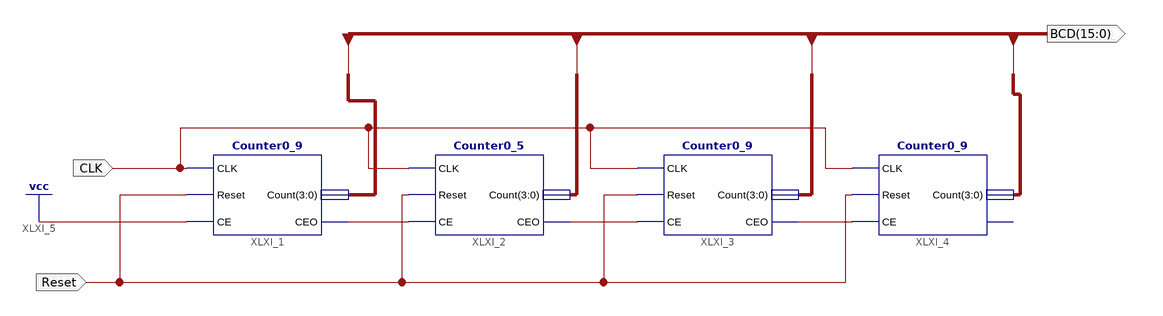
[diagram p0: schematic sheet 1]
// Xilinx ISE schematic Clock_MM_SS_2.sch (spartan6) as structural Verilog: 4 symbols, 3 ports
module Clock_MM_SS_2 (
  input  CLK,
  input  Reset,
  output [15:0] BCD
);

  wire XLXN_9, XLXN_10, XLXN_11;

  Counter0_9 XLXI_1 (.Reset(Reset), .CLK(CLK), .Count(BCD[3:0]), .CE(1'b1), .CEO(XLXN_9));
  Counter0_5 XLXI_2 (.Reset(Reset), .CLK(CLK), .CE(XLXN_9), .Count(BCD[7:4]), .CEO(XLXN_10));
  Counter0_9 XLXI_3 (.Reset(Reset), .CLK(CLK), .Count(BCD[11:8]), .CE(XLXN_10), .CEO(XLXN_11));
  Counter0_9 XLXI_4 (.Reset(Reset), .CLK(CLK), .Count(BCD[15:12]), .CE(XLXN_11));  // open: CEO
endmodule
